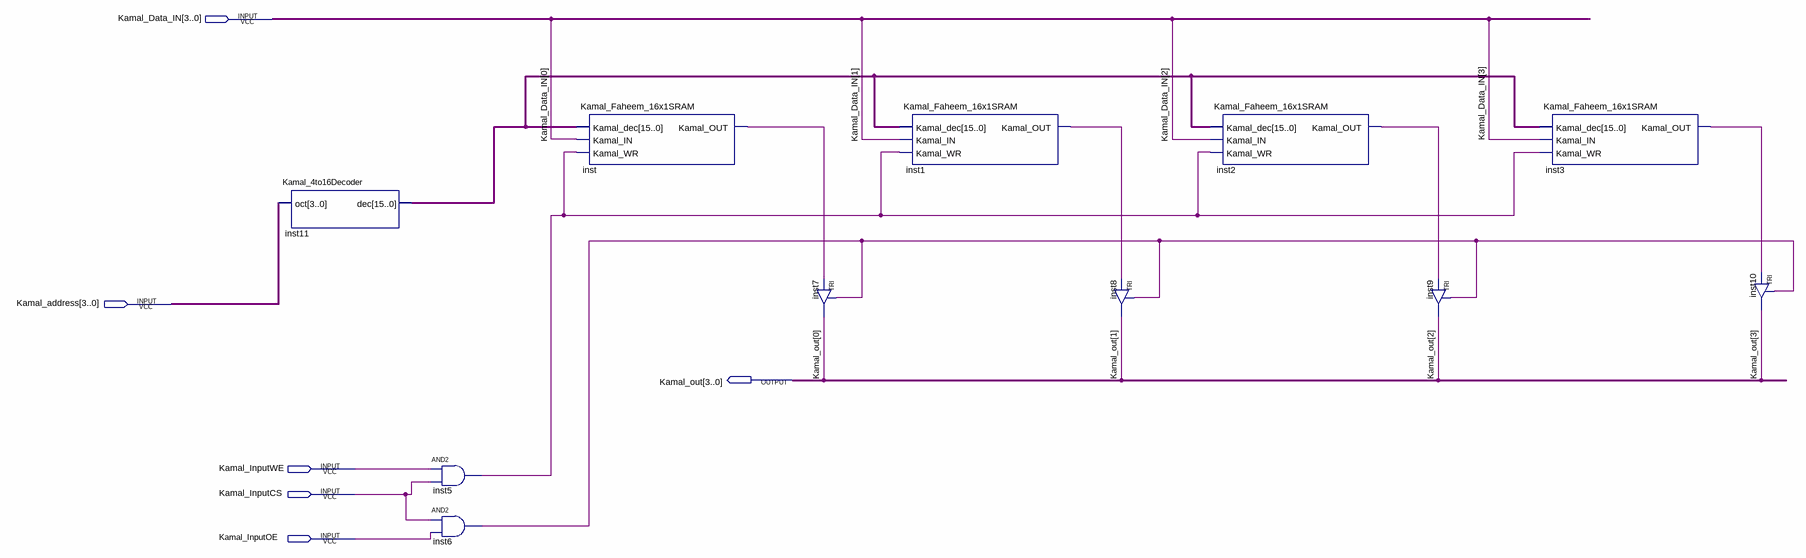
[diagram p0: schematic sheet]
// Quartus schematic Kamal_Faheem_16x4SRM.bdf as structural Verilog: 11 symbols, 6 pins
module Kamal_Faheem_16x4SRM (
  input  [3:0] Kamal_Data_IN,
  input  [3:0] Kamal_address,
  input  Kamal_InputWE,
  input  Kamal_InputCS,
  input  Kamal_InputOE,
  output [3:0] Kamal_out
);

  wire inst1_kamal_out, inst2_kamal_out, inst3_kamal_out, inst5_out, inst6_out, inst_kamal_out;
  wire [15:0] inst11_dec;

  Kamal_4to16Decoder inst11 (.oct(Kamal_address), .dec(inst11_dec));
  and inst5 (inst5_out, Kamal_InputWE, Kamal_InputCS);
  and inst6 (inst6_out, Kamal_InputCS, Kamal_InputOE);
  Kamal_Faheem_16x1SRAM inst (
    .Kamal_dec(inst11_dec), .Kamal_IN(Kamal_Data_IN[0]), .Kamal_WR(inst5_out), .Kamal_OUT(inst_kamal_out));
  TRI inst7 (.IN(inst_kamal_out), .OE(inst6_out), .OUT(Kamal_out[0]));
  Kamal_Faheem_16x1SRAM inst1 (
    .Kamal_dec(inst11_dec), .Kamal_IN(Kamal_Data_IN[1]), .Kamal_WR(inst5_out), .Kamal_OUT(inst1_kamal_out));
  TRI inst8 (.IN(inst1_kamal_out), .OE(inst6_out), .OUT(Kamal_out[1]));
  Kamal_Faheem_16x1SRAM inst2 (
    .Kamal_dec(inst11_dec), .Kamal_IN(Kamal_Data_IN[2]), .Kamal_WR(inst5_out), .Kamal_OUT(inst2_kamal_out));
  TRI inst9 (.IN(inst2_kamal_out), .OE(inst6_out), .OUT(Kamal_out[2]));
  Kamal_Faheem_16x1SRAM inst3 (
    .Kamal_dec(inst11_dec), .Kamal_IN(Kamal_Data_IN[3]), .Kamal_WR(inst5_out), .Kamal_OUT(inst3_kamal_out));
  TRI inst10 (.IN(inst3_kamal_out), .OE(inst6_out), .OUT(Kamal_out[3]));
endmodule
